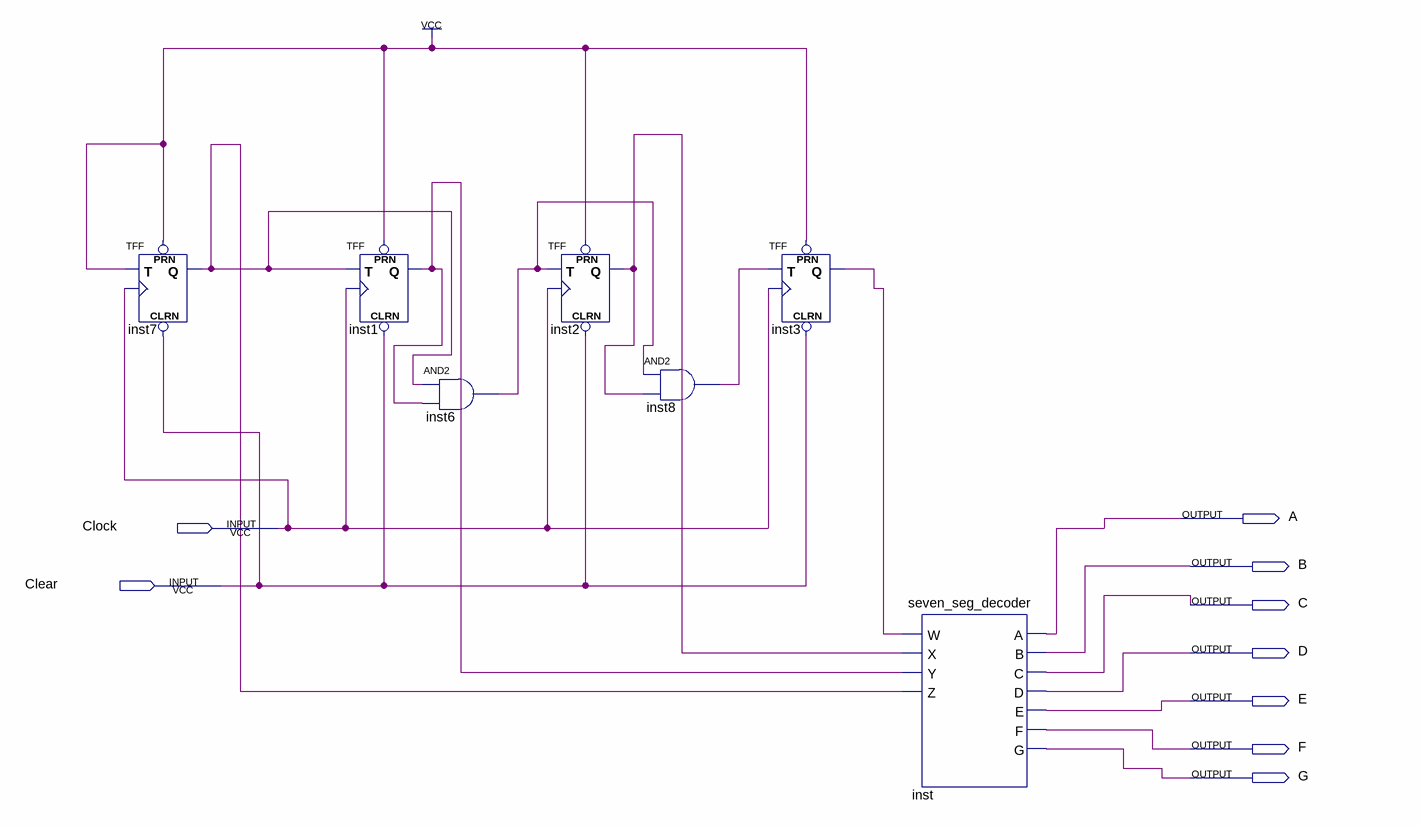
[diagram p0: schematic sheet]
// Quartus schematic lab10step3a.bdf as structural Verilog: 7 symbols, 9 pins
module lab10step3a (
  input  Clock,
  input  Clear,
  output A,
  output B,
  output C,
  output D,
  output E,
  output F,
  output G
);

  wire inst1_q, inst2_q, inst3_q, inst6_out, inst7_q, inst8_out;

  TFF inst7 (.PRN(1'b1), .CLRN(Clear), .T(1'b1), .CLK(Clock), .Q(inst7_q));
  TFF inst1 (.PRN(1'b1), .CLRN(Clear), .T(inst7_q), .CLK(Clock), .Q(inst1_q));
  and inst6 (inst6_out, inst7_q, inst1_q);
  TFF inst2 (.PRN(1'b1), .CLRN(Clear), .T(inst6_out), .CLK(Clock), .Q(inst2_q));
  and inst8 (inst8_out, inst6_out, inst2_q);
  TFF inst3 (.PRN(1'b1), .CLRN(Clear), .T(inst8_out), .CLK(Clock), .Q(inst3_q));
  seven_seg_decoder inst (
    .W(inst3_q), .X(inst2_q), .Y(inst1_q), .Z(inst7_q), .A(A), .B(B), .C(C), .D(D), .E(E), .F(F), .G(G));
endmodule
